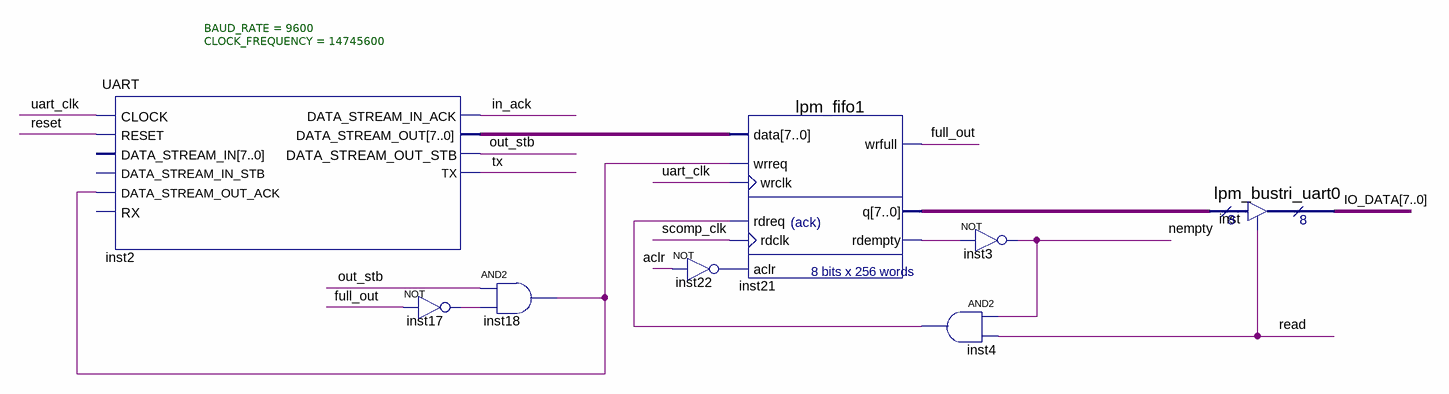
[diagram p0: schematic sheet]
// Quartus schematic UART_INTERFACE_OUT.bdf as structural Verilog: 8 symbols, 0 pins
module UART_INTERFACE_OUT (
);

  wire aclr, full_out, in_ack, inst4_out, inst17_out, inst18_out, inst21_rdempty, inst22_out, nempty,
       out_stb, read, reset, scomp_clk, tx, uart_clk;
  wire [7:0] inst2_data_stream_out, inst21_q, IO_DATA;

  UART #(.BAUD_RATE(9600), .CLOCK_FREQUENCY(14745600)) inst2 (
    .CLOCK(uart_clk), .RESET(reset), .DATA_STREAM_OUT_ACK(inst18_out), .DATA_STREAM_IN_ACK(in_ack),
    .DATA_STREAM_OUT(inst2_data_stream_out), .DATA_STREAM_OUT_STB(out_stb), .TX(tx));  // open: DATA_STREAM_IN, DATA_STREAM_IN_STB, RX
  not inst17 (inst17_out, full_out);
  and inst18 (inst18_out, out_stb, inst17_out);
  not inst22 (inst22_out, aclr);
  lpm_fifo1 inst21 (
    .data(inst2_data_stream_out), .wrreq(inst18_out), .wrclk(uart_clk), .rdreq(inst4_out), .rdclk(scomp_clk),
    .aclr(inst22_out), .wrfull(full_out), .q(inst21_q), .rdempty(inst21_rdempty));
  not inst3 (nempty, inst21_rdempty);
  and inst4 (inst4_out, nempty, read);
  lpm_bustri_uart0 inst (.enabledt(read), .data(inst21_q), .tridata(IO_DATA));
endmodule
